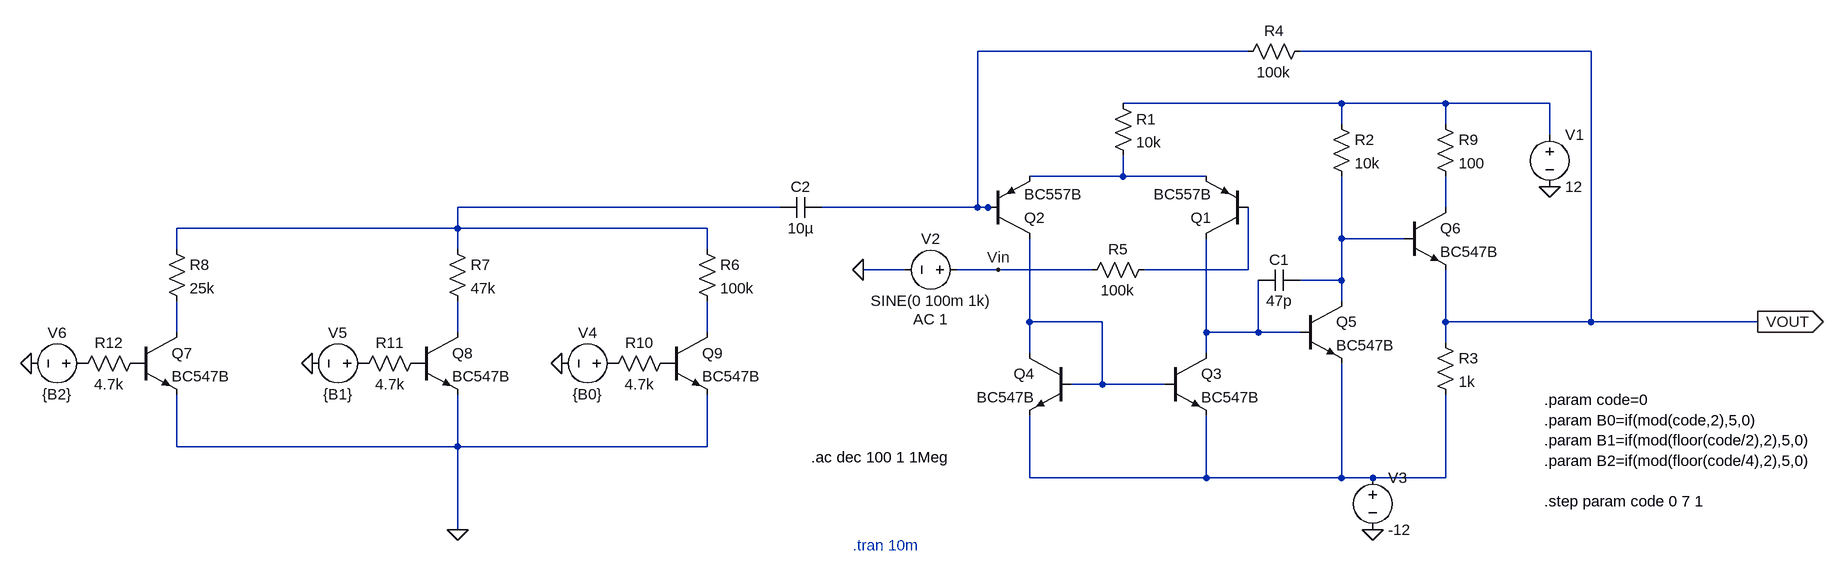
[diagram p0: schematic BJT-PGA.asc]
BJT-PGA.asc, the LTspice schematic file:
Version 4.1
SHEET 1 1580 800
WIRE 656 -208 240 -208
WIRE 1184 -208 736 -208
WIRE 800 -128 464 -128
WIRE 960 -128 800 -128
WIRE 1120 -128 960 -128
WIRE 800 -96 800 -128
WIRE 960 -96 960 -128
WIRE 1120 -80 1120 -128
WIRE 464 -16 464 -48
WIRE 464 -16 320 -16
WIRE 592 -16 464 -16
WIRE -64 32 -560 32
WIRE 240 32 240 -208
WIRE 240 32 0 32
WIRE 256 32 240 32
WIRE 272 32 256 32
WIRE 960 32 960 -16
WIRE -560 64 -560 32
WIRE -560 64 -992 64
WIRE -176 64 -560 64
WIRE 800 80 800 -16
WIRE 896 80 800 80
WIRE -992 96 -992 64
WIRE -560 96 -560 64
WIRE -176 96 -176 64
WIRE 128 128 64 128
WIRE 272 128 208 128
WIRE 416 128 272 128
WIRE 656 128 656 32
WIRE 656 128 496 128
WIRE 800 144 800 80
WIRE 800 144 736 144
WIRE 800 176 800 144
WIRE 320 208 320 80
WIRE 432 208 320 208
WIRE 960 208 960 128
WIRE 1184 208 1184 -208
WIRE 1184 208 960 208
WIRE 1440 208 1184 208
WIRE -992 224 -992 176
WIRE -560 224 -560 176
WIRE -176 224 -176 176
WIRE 592 224 592 80
WIRE 672 224 672 144
WIRE 672 224 592 224
WIRE 736 224 672 224
WIRE 960 240 960 208
WIRE 320 256 320 208
WIRE 592 256 592 224
WIRE 432 304 432 208
WIRE 432 304 384 304
WIRE 528 304 432 304
WIRE -992 400 -992 320
WIRE -560 400 -560 320
WIRE -560 400 -992 400
WIRE -176 400 -176 320
WIRE -176 400 -560 400
WIRE 320 448 320 352
WIRE 592 448 592 352
WIRE 592 448 320 448
WIRE 800 448 800 272
WIRE 800 448 592 448
WIRE 848 448 800 448
WIRE 960 448 960 320
WIRE 960 448 848 448
WIRE -560 528 -560 400
FLAG 1120 0 0
FLAG 64 128 0
FLAG 848 528 0
FLAG 1440 208 VOUT
IOPIN 1440 208 Out
FLAG -560 528 0
FLAG -400 272 0
FLAG -784 272 0
FLAG -1216 272 0
FLAG 272 128 Vin
SYMBOL pnp 656 80 R180
SYMATTR InstName Q1
SYMATTR Value BC557B
SYMBOL pnp 256 80 M180
SYMATTR InstName Q2
SYMATTR Value BC557B
SYMBOL npn 528 256 R0
SYMATTR InstName Q3
SYMATTR Value BC547B
SYMBOL npn 384 256 M0
SYMATTR InstName Q4
SYMATTR Value BC547B
SYMBOL res 448 -144 R0
SYMATTR InstName R1
SYMATTR Value 10k
SYMBOL npn 736 176 R0
SYMATTR InstName Q5
SYMATTR Value BC547B
SYMBOL res 784 -112 R0
SYMATTR InstName R2
SYMATTR Value 10k
SYMBOL voltage 1120 -96 R0
SYMATTR InstName V1
SYMATTR Value 12
SYMBOL cap 736 128 R90
WINDOW 0 0 32 VBottom 2
WINDOW 3 32 32 VTop 2
SYMATTR InstName C1
SYMATTR Value 47p
SYMBOL voltage 224 128 R90
WINDOW 0 -32 56 VBottom 2
WINDOW 3 32 56 VTop 2
WINDOW 123 60 56 VTop 2
WINDOW 39 0 0 Left 0
SYMATTR InstName V2
SYMATTR Value SINE(0 100m 1k)
SYMATTR Value2 AC 1
SYMBOL voltage 848 432 R0
SYMATTR InstName V3
SYMATTR Value -12
SYMBOL res 944 224 R0
SYMATTR InstName R3
SYMATTR Value 1k
SYMBOL npn 896 32 R0
SYMATTR InstName Q6
SYMATTR Value BC547B
SYMBOL res 752 -224 R90
WINDOW 0 0 56 VBottom 2
WINDOW 3 32 56 VTop 2
SYMATTR InstName R4
SYMATTR Value 100k
SYMBOL res 512 112 R90
WINDOW 0 0 56 VBottom 2
WINDOW 3 32 56 VTop 2
SYMATTR InstName R5
SYMATTR Value 100k
SYMBOL res -192 80 R0
SYMATTR InstName R6
SYMATTR Value 100k
SYMBOL res -576 80 R0
SYMATTR InstName R7
SYMATTR Value 47k
SYMBOL res -1008 80 R0
SYMATTR InstName R8
SYMATTR Value 25k
SYMBOL cap 0 16 R90
WINDOW 0 0 32 VBottom 2
WINDOW 3 32 32 VTop 2
SYMATTR InstName C2
SYMATTR Value 10µ
SYMBOL npn -1056 224 R0
SYMATTR InstName Q7
SYMATTR Value BC547B
SYMBOL npn -624 224 R0
SYMATTR InstName Q8
SYMATTR Value BC547B
SYMBOL npn -240 224 R0
SYMATTR InstName Q9
SYMATTR Value BC547B
SYMBOL res 944 -112 R0
SYMATTR InstName R9
SYMATTR Value 100
SYMBOL res -224 256 R90
WINDOW 0 0 56 VBottom 2
WINDOW 3 32 56 VTop 2
SYMATTR InstName R10
SYMATTR Value 4.7k
SYMBOL res -608 256 R90
WINDOW 0 0 56 VBottom 2
WINDOW 3 32 56 VTop 2
SYMATTR InstName R11
SYMATTR Value 4.7k
SYMBOL res -1040 256 R90
WINDOW 0 0 56 VBottom 2
WINDOW 3 32 56 VTop 2
SYMATTR InstName R12
SYMATTR Value 4.7k
SYMBOL voltage -304 272 R90
WINDOW 0 -32 56 VBottom 2
WINDOW 3 32 56 VTop 2
SYMATTR InstName V4
SYMATTR Value {B0}
SYMBOL voltage -688 272 R90
WINDOW 0 -32 56 VBottom 2
WINDOW 3 32 56 VTop 2
SYMATTR InstName V5
SYMATTR Value {B1}
SYMBOL voltage -1120 272 R90
WINDOW 0 -32 56 VBottom 2
WINDOW 3 32 56 VTop 2
SYMATTR InstName V6
SYMATTR Value {B2}
TEXT 48 552 Left 2 ;.tran 10m
TEXT -16 416 Left 2 !.ac dec 100 1 1Meg
TEXT 1112 328 Left 2 !.param code=0\n.param B0=if(mod(code,2),5,0)\n.param B1=if(mod(floor(code/2),2),5,0)\n.param B2=if(mod(floor(code/4),2),5,0)\n \n.step param code 0 7 1

The netlist it stands for:
* BJT-PGA.asc
Q1 N012 N007 N003 0 BC557B
Q2 N008 N001 N003 0 BC557B
Q3 N012 N008 N013 0 BC547B
Q4 N008 N008 N013 0 BC547B
R1 N002 N003 10k
Q5 N006 N012 N013 0 BC547B
R2 N002 N006 10k
V1 N002 0 12
C1 N006 N012 47p
V2 Vin 0 SINE(0 100m 1k) AC 1
V3 N013 0 -12
R3 VOUT N013 1k
Q6 N005 N006 VOUT 0 BC547B
R4 VOUT N001 100k
R5 N007 Vin 100k
R6 N004 N011 100k
R7 N004 N010 47k
R8 N004 N009 25k
C2 N001 N004 10µ
Q7 N009 P001 0 0 BC547B
Q8 N010 P002 0 0 BC547B
Q9 N011 P003 0 0 BC547B
R9 N002 N005 100
R10 P003 P004 4.7k
R11 P002 P005 4.7k
R12 P001 P006 4.7k
V4 P004 0 {B0}
V5 P005 0 {B1}
V6 P006 0 {B2}
.model NPN NPN
.model PNP PNP
.lib standard.bjt
* .tran 10m
.ac dec 100 1 1Meg
.param code=0
.param B0=if(mod(code,2),5,0)
.param B1=if(mod(floor(code/2),2),5,0)
.param B2=if(mod(floor(code/4),2),5,0)
.step param code 0 7 1
.backanno
.end